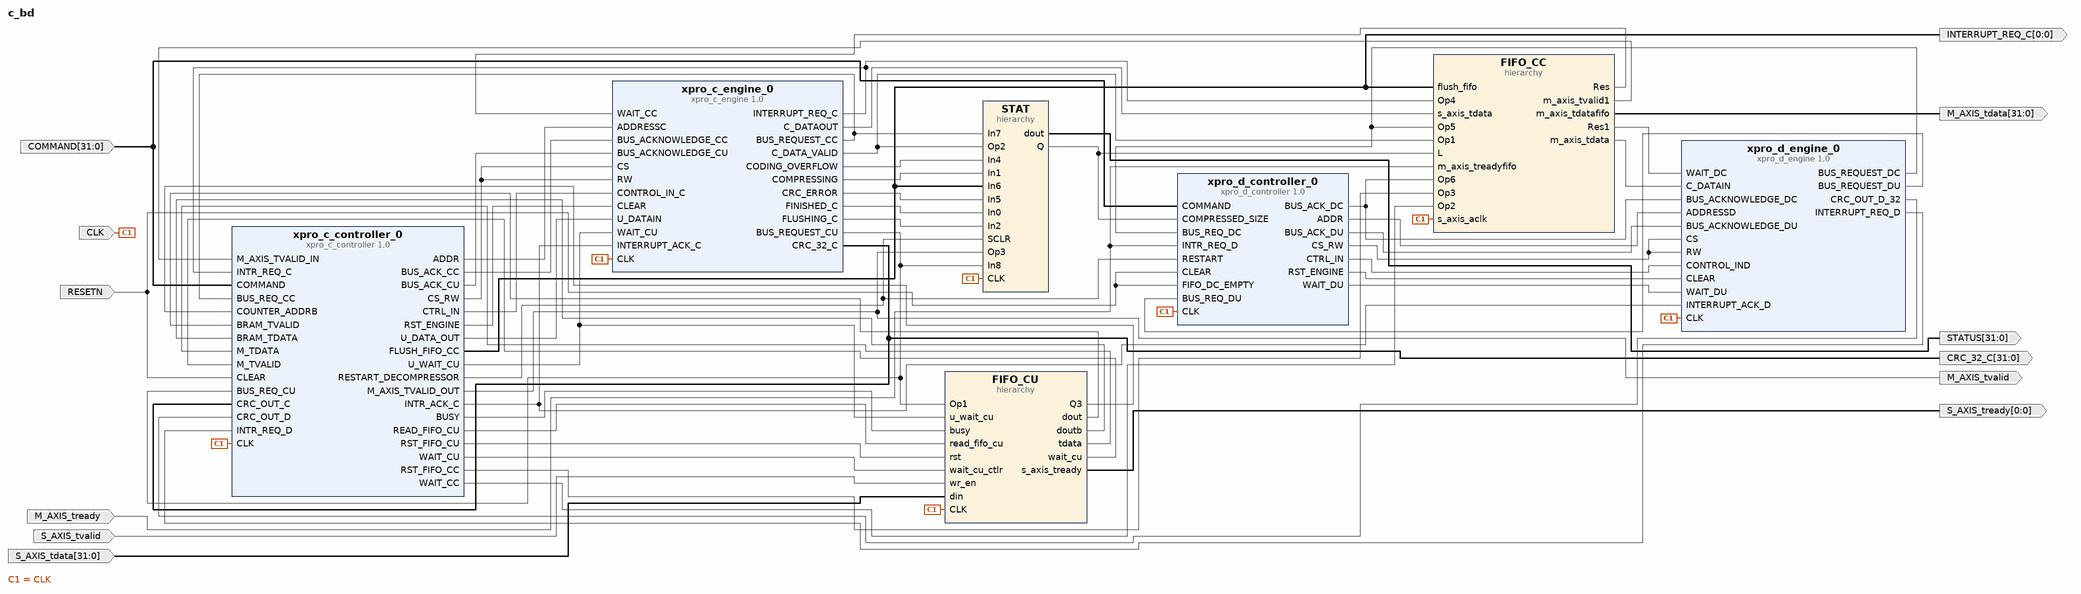
[diagram p0: block diagram of the top level]
# Vivado block design c_bd, Vivado 2014.4
create_bd_design c_bd

create_bd_port -dir I -type clk CLK
create_bd_port -dir I -from 31 -to 0 COMMAND
create_bd_port -dir O -from 31 -to 0 CRC_32_C
create_bd_port -dir O -from 0 -to 0 INTERRUPT_REQ_C
create_bd_port -dir O -from 31 -to 0 M_AXIS_tdata
create_bd_port -dir I M_AXIS_tready
create_bd_port -dir O M_AXIS_tvalid
create_bd_port -dir I RESETN
create_bd_port -dir O -from 31 -to 0 STATUS
create_bd_port -dir I -from 31 -to 0 S_AXIS_tdata
create_bd_port -dir O -from 0 -to 0 S_AXIS_tready
create_bd_port -dir I S_AXIS_tvalid

create_bd_cell -type hier FIFO_CC
create_bd_cell -type hier FIFO_CU
create_bd_cell -type hier STAT
create_bd_cell -type ip -vlnv mohdazainol:user_ip:xpro_c_controller:1.0 xpro_c_controller_0
create_bd_cell -type ip -vlnv mohdazainol:user_ip:xpro_c_engine:1.0 xpro_c_engine_0
create_bd_cell -type ip -vlnv mohdazainol:user_ip:xpro_d_controller:1.0 xpro_d_controller_0
create_bd_cell -type ip -vlnv mohdazainol:user_ip:xpro_d_engine:1.0 xpro_d_engine_0

# ---- hierarchy /FIFO_CC ----
current_bd_instance /FIFO_CC
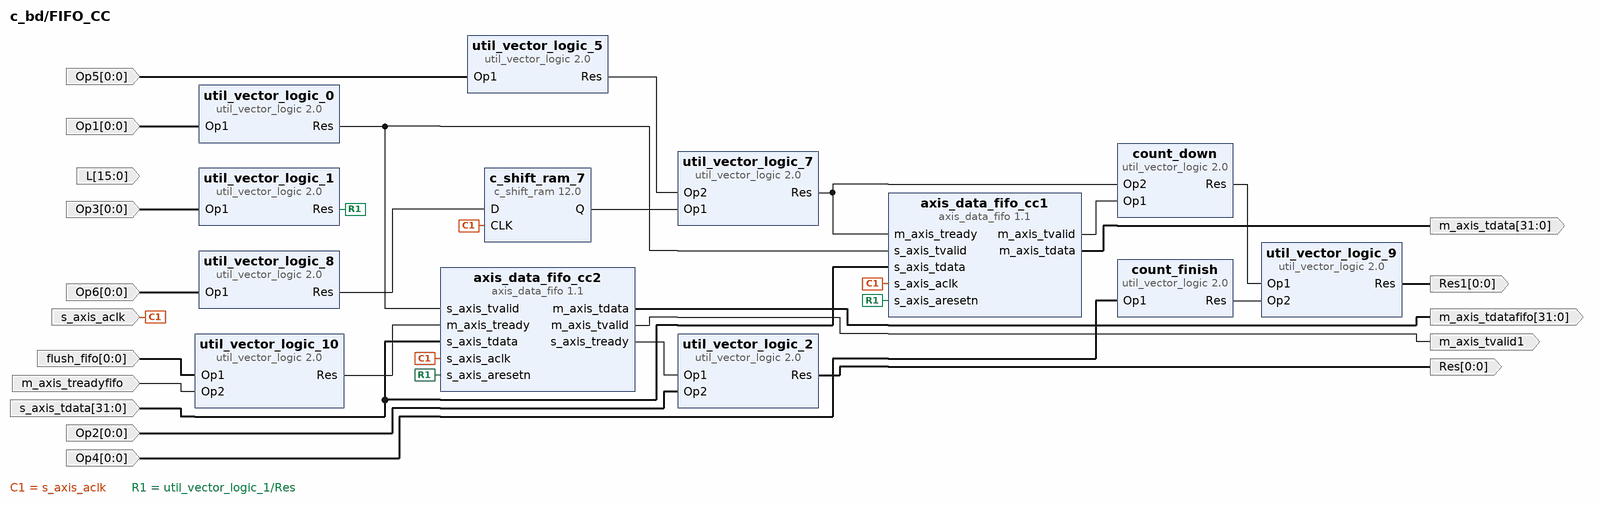
[diagram p1: block diagram inside /FIFO_CC]
create_bd_pin -dir I -from 15 -to 0 L
create_bd_pin -dir I -from 0 -to 0 Op1
create_bd_pin -dir I -from 0 -to 0 Op2
create_bd_pin -dir I -from 0 -to 0 Op3
create_bd_pin -dir I -from 0 -to 0 Op4
create_bd_pin -dir I -from 0 -to 0 Op5
create_bd_pin -dir I -from 0 -to 0 Op6
create_bd_pin -dir O -from 0 -to 0 Res
create_bd_pin -dir O -from 0 -to 0 Res1
create_bd_pin -dir I -from 0 -to 0 flush_fifo
create_bd_pin -dir O -from 31 -to 0 m_axis_tdata
create_bd_pin -dir O -from 31 -to 0 m_axis_tdatafifo
create_bd_pin -dir I m_axis_treadyfifo
create_bd_pin -dir O m_axis_tvalid1
create_bd_pin -dir I -type clk s_axis_aclk
create_bd_pin -dir I -from 31 -to 0 s_axis_tdata

create_bd_cell -type ip -vlnv xilinx.com:ip:axis_data_fifo:1.1 axis_data_fifo_cc1
set_property -dict {CONFIG.TDATA_NUM_BYTES 4 CONFIG.FIFO_DEPTH 64} [get_bd_cells axis_data_fifo_cc1]
create_bd_cell -type ip -vlnv xilinx.com:ip:axis_data_fifo:1.1 axis_data_fifo_cc2
set_property -dict {CONFIG.TDATA_NUM_BYTES 4} [get_bd_cells axis_data_fifo_cc2]
create_bd_cell -type ip -vlnv xilinx.com:ip:c_shift_ram:12.0 c_shift_ram_7
set_property -dict [list \
  CONFIG.ShiftRegType Fixed_Length \
  CONFIG.CE false \
  CONFIG.Width 1 \
  CONFIG.Depth 1 \
  CONFIG.DefaultData 0 \
  CONFIG.AsyncInitVal 0 \
] [get_bd_cells c_shift_ram_7]
create_bd_cell -type ip -vlnv xilinx.com:ip:util_vector_logic:2.0 count_down
set_property -dict {CONFIG.C_SIZE 1} [get_bd_cells count_down]
create_bd_cell -type ip -vlnv xilinx.com:ip:util_vector_logic:2.0 count_finish
set_property -dict {CONFIG.C_SIZE 1 CONFIG.C_OPERATION not} [get_bd_cells count_finish]
create_bd_cell -type ip -vlnv xilinx.com:ip:util_vector_logic:2.0 util_vector_logic_0
set_property -dict {CONFIG.C_SIZE 1 CONFIG.C_OPERATION not} [get_bd_cells util_vector_logic_0]
create_bd_cell -type ip -vlnv xilinx.com:ip:util_vector_logic:2.0 util_vector_logic_1
set_property -dict {CONFIG.C_SIZE 1 CONFIG.C_OPERATION not} [get_bd_cells util_vector_logic_1]
create_bd_cell -type ip -vlnv xilinx.com:ip:util_vector_logic:2.0 util_vector_logic_2
set_property -dict {CONFIG.C_SIZE 1} [get_bd_cells util_vector_logic_2]
create_bd_cell -type ip -vlnv xilinx.com:ip:util_vector_logic:2.0 util_vector_logic_5
set_property -dict {CONFIG.C_SIZE 1 CONFIG.C_OPERATION not} [get_bd_cells util_vector_logic_5]
create_bd_cell -type ip -vlnv xilinx.com:ip:util_vector_logic:2.0 util_vector_logic_7
set_property -dict {CONFIG.C_SIZE 1} [get_bd_cells util_vector_logic_7]
create_bd_cell -type ip -vlnv xilinx.com:ip:util_vector_logic:2.0 util_vector_logic_8
set_property -dict {CONFIG.C_SIZE 1 CONFIG.C_OPERATION not} [get_bd_cells util_vector_logic_8]
create_bd_cell -type ip -vlnv xilinx.com:ip:util_vector_logic:2.0 util_vector_logic_9
set_property -dict {CONFIG.C_SIZE 1 CONFIG.C_OPERATION or} [get_bd_cells util_vector_logic_9]
create_bd_cell -type ip -vlnv xilinx.com:ip:util_vector_logic:2.0 util_vector_logic_10
set_property -dict {CONFIG.C_SIZE 1} [get_bd_cells util_vector_logic_10]

# ---- hierarchy /FIFO_CU ----
current_bd_instance /FIFO_CU
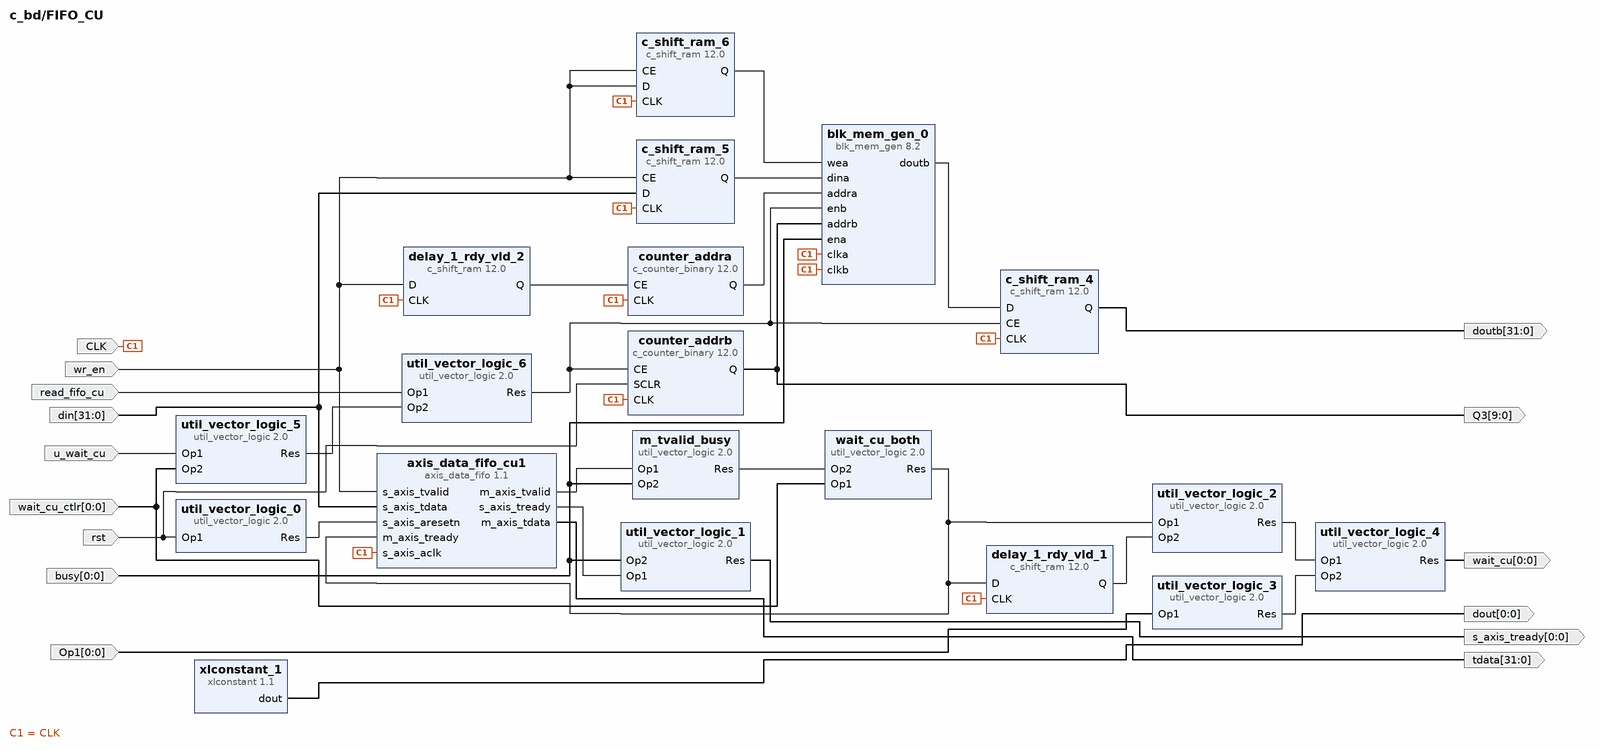
[diagram p2: block diagram inside /FIFO_CU]
create_bd_pin -dir I -type clk CLK
create_bd_pin -dir I -from 0 -to 0 Op1
create_bd_pin -dir O -from 9 -to 0 -type data Q3
create_bd_pin -dir I -from 0 -to 0 -type data busy
create_bd_pin -dir I -from 31 -to 0 din
create_bd_pin -dir O -from 0 -to 0 dout
create_bd_pin -dir O -from 31 -to 0 doutb
create_bd_pin -dir I -type ce read_fifo_cu
create_bd_pin -dir I rst
create_bd_pin -dir O -from 0 -to 0 s_axis_tready
create_bd_pin -dir O -from 31 -to 0 -type data tdata
create_bd_pin -dir I -type ce u_wait_cu
create_bd_pin -dir O -from 0 -to 0 wait_cu
create_bd_pin -dir I -from 0 -to 0 wait_cu_ctlr
create_bd_pin -dir I wr_en

create_bd_cell -type ip -vlnv xilinx.com:ip:axis_data_fifo:1.1 axis_data_fifo_cu1
set_property -dict {CONFIG.TDATA_NUM_BYTES 4 CONFIG.FIFO_DEPTH 64} [get_bd_cells axis_data_fifo_cu1]
create_bd_cell -type ip -vlnv xilinx.com:ip:blk_mem_gen:8.2 blk_mem_gen_0
set_property -dict [list \
  CONFIG.Memory_Type Simple_Dual_Port_RAM \
  CONFIG.Enable_32bit_Address false \
  CONFIG.Use_Byte_Write_Enable false \
  CONFIG.Write_Depth_A 1024 \
  CONFIG.Operating_Mode_A WRITE_FIRST \
  CONFIG.Enable_A Use_ENA_Pin \
  CONFIG.Enable_B Use_ENB_Pin \
  CONFIG.Register_PortB_Output_of_Memory_Primitives false \
  CONFIG.Port_B_Clock 100 \
  CONFIG.Port_B_Enable_Rate 100 \
  CONFIG.use_bram_block Stand_Alone \
] [get_bd_cells blk_mem_gen_0]
create_bd_cell -type ip -vlnv xilinx.com:ip:c_shift_ram:12.0 c_shift_ram_4
set_property -dict [list \
  CONFIG.ShiftRegType Fixed_Length \
  CONFIG.CE true \
  CONFIG.Width 32 \
  CONFIG.Depth 1 \
  CONFIG.DefaultData 00000000000000000000000000000000 \
  CONFIG.AsyncInitVal 00000000000000000000000000000000 \
] [get_bd_cells c_shift_ram_4]
create_bd_cell -type ip -vlnv xilinx.com:ip:c_shift_ram:12.0 c_shift_ram_5
set_property -dict [list \
  CONFIG.ShiftRegType Fixed_Length \
  CONFIG.CE true \
  CONFIG.Width 32 \
  CONFIG.Depth 1 \
  CONFIG.DefaultData 00000000000000000000000000000000 \
  CONFIG.AsyncInitVal 00000000000000000000000000000000 \
] [get_bd_cells c_shift_ram_5]
create_bd_cell -type ip -vlnv xilinx.com:ip:c_shift_ram:12.0 c_shift_ram_6
set_property -dict [list \
  CONFIG.ShiftRegType Fixed_Length \
  CONFIG.CE true \
  CONFIG.Width 1 \
  CONFIG.Depth 1 \
  CONFIG.DefaultData 0 \
  CONFIG.AsyncInitVal 0 \
] [get_bd_cells c_shift_ram_6]
create_bd_cell -type ip -vlnv xilinx.com:ip:c_counter_binary:12.0 counter_addra
set_property -dict [list \
  CONFIG.Output_Width 10 \
  CONFIG.Restrict_Count false \
  CONFIG.CE true \
  CONFIG.SCLR false \
] [get_bd_cells counter_addra]
create_bd_cell -type ip -vlnv xilinx.com:ip:c_counter_binary:12.0 counter_addrb
set_property -dict [list \
  CONFIG.Output_Width 10 \
  CONFIG.Restrict_Count false \
  CONFIG.CE true \
  CONFIG.SCLR true \
] [get_bd_cells counter_addrb]
create_bd_cell -type ip -vlnv xilinx.com:ip:c_shift_ram:12.0 delay_1_rdy_vld_1
set_property -dict {CONFIG.Width 1 CONFIG.Depth 1 CONFIG.DefaultData 0 CONFIG.AsyncInitVal 0} [get_bd_cells delay_1_rdy_vld_1]
create_bd_cell -type ip -vlnv xilinx.com:ip:c_shift_ram:12.0 delay_1_rdy_vld_2
set_property -dict {CONFIG.Width 1 CONFIG.Depth 1 CONFIG.DefaultData 0 CONFIG.AsyncInitVal 0} [get_bd_cells delay_1_rdy_vld_2]
create_bd_cell -type ip -vlnv xilinx.com:ip:util_vector_logic:2.0 m_tvalid_busy
set_property -dict {CONFIG.C_SIZE 1} [get_bd_cells m_tvalid_busy]
create_bd_cell -type ip -vlnv xilinx.com:ip:util_vector_logic:2.0 util_vector_logic_0
set_property -dict {CONFIG.C_SIZE 1 CONFIG.C_OPERATION not} [get_bd_cells util_vector_logic_0]
create_bd_cell -type ip -vlnv xilinx.com:ip:util_vector_logic:2.0 util_vector_logic_1
set_property -dict {CONFIG.C_SIZE 1} [get_bd_cells util_vector_logic_1]
create_bd_cell -type ip -vlnv xilinx.com:ip:util_vector_logic:2.0 util_vector_logic_2
set_property -dict {CONFIG.C_SIZE 1 CONFIG.C_OPERATION or} [get_bd_cells util_vector_logic_2]
create_bd_cell -type ip -vlnv xilinx.com:ip:util_vector_logic:2.0 util_vector_logic_3
set_property -dict {CONFIG.C_SIZE 1 CONFIG.C_OPERATION not} [get_bd_cells util_vector_logic_3]
create_bd_cell -type ip -vlnv xilinx.com:ip:util_vector_logic:2.0 util_vector_logic_4
set_property -dict {CONFIG.C_SIZE 1} [get_bd_cells util_vector_logic_4]
create_bd_cell -type ip -vlnv xilinx.com:ip:util_vector_logic:2.0 util_vector_logic_5
set_property -dict {CONFIG.C_SIZE 1} [get_bd_cells util_vector_logic_5]
create_bd_cell -type ip -vlnv xilinx.com:ip:util_vector_logic:2.0 util_vector_logic_6
set_property -dict {CONFIG.C_SIZE 1 CONFIG.C_OPERATION or} [get_bd_cells util_vector_logic_6]
create_bd_cell -type ip -vlnv xilinx.com:ip:util_vector_logic:2.0 wait_cu_both
set_property -dict {CONFIG.C_SIZE 1} [get_bd_cells wait_cu_both]
create_bd_cell -type ip -vlnv xilinx.com:ip:xlconstant:1.1 xlconstant_1

# ---- hierarchy /STAT ----
current_bd_instance /STAT
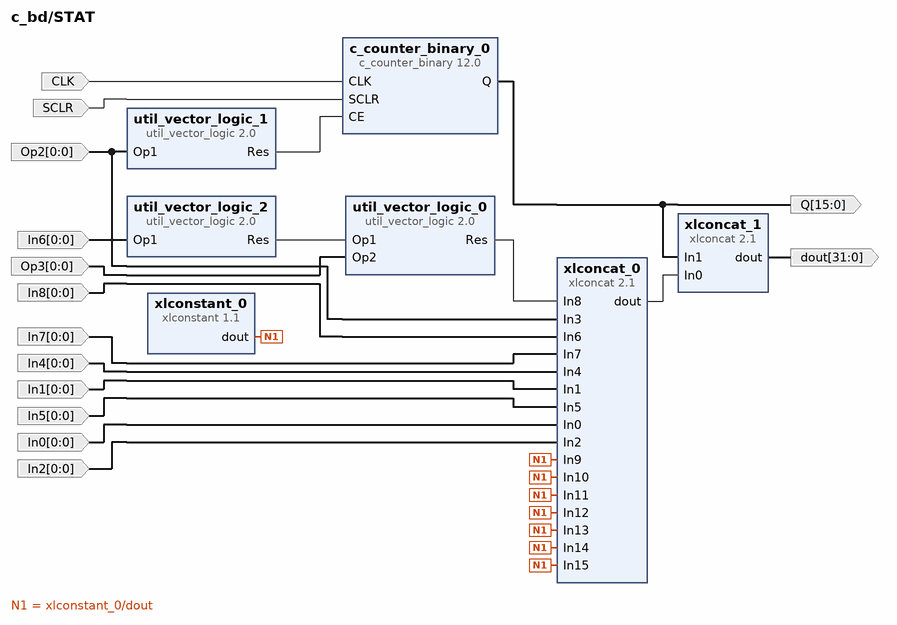
[diagram p3: block diagram inside /STAT]
create_bd_pin -dir I -type clk CLK
create_bd_pin -dir I -from 0 -to 0 In0
create_bd_pin -dir I -from 0 -to 0 In1
create_bd_pin -dir I -from 0 -to 0 In2
create_bd_pin -dir I -from 0 -to 0 In4
create_bd_pin -dir I -from 0 -to 0 In5
create_bd_pin -dir I -from 0 -to 0 In6
create_bd_pin -dir I -from 0 -to 0 In7
create_bd_pin -dir I -from 0 -to 0 In8
create_bd_pin -dir I -from 0 -to 0 Op2
create_bd_pin -dir I -from 0 -to 0 Op3
create_bd_pin -dir O -from 15 -to 0 Q
create_bd_pin -dir I -type rst SCLR
create_bd_pin -dir O -from 31 -to 0 dout

create_bd_cell -type ip -vlnv xilinx.com:ip:c_counter_binary:12.0 c_counter_binary_0
set_property -dict {CONFIG.CE true CONFIG.SCLR true} [get_bd_cells c_counter_binary_0]
create_bd_cell -type ip -vlnv xilinx.com:ip:util_vector_logic:2.0 util_vector_logic_0
set_property -dict {CONFIG.C_SIZE 1 CONFIG.C_OPERATION or} [get_bd_cells util_vector_logic_0]
create_bd_cell -type ip -vlnv xilinx.com:ip:util_vector_logic:2.0 util_vector_logic_1
set_property -dict {CONFIG.C_SIZE 1 CONFIG.C_OPERATION not} [get_bd_cells util_vector_logic_1]
create_bd_cell -type ip -vlnv xilinx.com:ip:util_vector_logic:2.0 util_vector_logic_2
set_property -dict {CONFIG.C_SIZE 1 CONFIG.C_OPERATION not} [get_bd_cells util_vector_logic_2]
create_bd_cell -type ip -vlnv xilinx.com:ip:xlconcat:2.1 xlconcat_0
set_property -dict {CONFIG.NUM_PORTS 16} [get_bd_cells xlconcat_0]
create_bd_cell -type ip -vlnv xilinx.com:ip:xlconcat:2.1 xlconcat_1
set_property -dict {CONFIG.IN0_WIDTH 16 CONFIG.IN1_WIDTH 16} [get_bd_cells xlconcat_1]
create_bd_cell -type ip -vlnv xilinx.com:ip:xlconstant:1.1 xlconstant_0
set_property -dict {CONFIG.CONST_VAL 0} [get_bd_cells xlconstant_0]

# ---- connections ----

current_bd_instance /FIFO_CC
connect_bd_net -net Op1_1 [get_bd_pins Op1] [get_bd_pins util_vector_logic_0/Op1]
connect_bd_net -net Op2_1 [get_bd_pins Op2] [get_bd_pins util_vector_logic_2/Op2]
connect_bd_net -net Op3_1 [get_bd_pins Op3] [get_bd_pins util_vector_logic_1/Op1]
connect_bd_net -net Op4_1 [get_bd_pins Op4] [get_bd_pins count_finish/Op1]
connect_bd_net -net Op5_1 [get_bd_pins Op5] [get_bd_pins util_vector_logic_5/Op1]
connect_bd_net -net Op6_1 [get_bd_pins Op6] [get_bd_pins util_vector_logic_8/Op1]
connect_bd_net -net Op7_1 [get_bd_pins flush_fifo] [get_bd_pins util_vector_logic_10/Op1]
connect_bd_net -net axis_data_fifo_0_m_axis_tdata [get_bd_pins axis_data_fifo_cc2/m_axis_tdata] [get_bd_pins m_axis_tdatafifo]
connect_bd_net -net axis_data_fifo_0_m_axis_tvalid [get_bd_pins axis_data_fifo_cc2/m_axis_tvalid] [get_bd_pins m_axis_tvalid1]
connect_bd_net -net axis_data_fifo_0_s_axis_tready [get_bd_pins axis_data_fifo_cc2/s_axis_tready] [get_bd_pins util_vector_logic_2/Op1]
connect_bd_net -net axis_data_fifo_1_m_axis_tdata [get_bd_pins axis_data_fifo_cc1/m_axis_tdata] [get_bd_pins m_axis_tdata]
connect_bd_net -net axis_data_fifo_1_m_axis_tvalid [get_bd_pins axis_data_fifo_cc1/m_axis_tvalid] [get_bd_pins count_down/Op1]
connect_bd_net [get_bd_pins c_shift_ram_7/Q] [get_bd_pins util_vector_logic_7/Op1]
connect_bd_net [get_bd_pins count_down/Res] [get_bd_pins util_vector_logic_9/Op1]
connect_bd_net [get_bd_pins count_finish/Res] [get_bd_pins util_vector_logic_9/Op2]
connect_bd_net [get_bd_pins m_axis_treadyfifo] [get_bd_pins util_vector_logic_10/Op2]
connect_bd_net [get_bd_pins s_axis_aclk] \
  [get_bd_pins axis_data_fifo_cc1/s_axis_aclk] [get_bd_pins axis_data_fifo_cc2/s_axis_aclk] [get_bd_pins c_shift_ram_7/CLK]
connect_bd_net [get_bd_pins s_axis_tdata] [get_bd_pins axis_data_fifo_cc1/s_axis_tdata] [get_bd_pins axis_data_fifo_cc2/s_axis_tdata]
connect_bd_net [get_bd_pins util_vector_logic_0/Res] [get_bd_pins axis_data_fifo_cc1/s_axis_tvalid] [get_bd_pins axis_data_fifo_cc2/s_axis_tvalid]
connect_bd_net [get_bd_pins util_vector_logic_10/Res] [get_bd_pins axis_data_fifo_cc2/m_axis_tready]
connect_bd_net [get_bd_pins util_vector_logic_1/Res] [get_bd_pins axis_data_fifo_cc1/s_axis_aresetn] [get_bd_pins axis_data_fifo_cc2/s_axis_aresetn]
connect_bd_net [get_bd_pins util_vector_logic_2/Res] [get_bd_pins Res]
connect_bd_net [get_bd_pins util_vector_logic_5/Res] [get_bd_pins util_vector_logic_7/Op2]
connect_bd_net [get_bd_pins util_vector_logic_7/Res] [get_bd_pins axis_data_fifo_cc1/m_axis_tready] [get_bd_pins count_down/Op2]
connect_bd_net [get_bd_pins util_vector_logic_8/Res] [get_bd_pins c_shift_ram_7/D]
connect_bd_net [get_bd_pins util_vector_logic_9/Res] [get_bd_pins Res1]

current_bd_instance /FIFO_CU
connect_bd_net -net CE1_1 [get_bd_pins read_fifo_cu] [get_bd_pins util_vector_logic_6/Op1]
connect_bd_net -net CE_1 [get_bd_pins u_wait_cu] [get_bd_pins util_vector_logic_5/Op1]
connect_bd_net [get_bd_pins CLK] \
  [get_bd_pins axis_data_fifo_cu1/s_axis_aclk] [get_bd_pins blk_mem_gen_0/clka] [get_bd_pins blk_mem_gen_0/clkb] \
  [get_bd_pins c_shift_ram_4/CLK] [get_bd_pins c_shift_ram_5/CLK] [get_bd_pins c_shift_ram_6/CLK] \
  [get_bd_pins counter_addra/CLK] [get_bd_pins counter_addrb/CLK] [get_bd_pins delay_1_rdy_vld_1/CLK] \
  [get_bd_pins delay_1_rdy_vld_2/CLK]
connect_bd_net -net Op1_2 [get_bd_pins Op1] [get_bd_pins util_vector_logic_3/Op1]
connect_bd_net -net axis_data_fifo_0_m_axis_tdata [get_bd_pins axis_data_fifo_cu1/m_axis_tdata] [get_bd_pins tdata]
connect_bd_net -net axis_data_fifo_0_m_axis_tvalid [get_bd_pins axis_data_fifo_cu1/m_axis_tvalid] [get_bd_pins m_tvalid_busy/Op1]
connect_bd_net -net axis_data_fifo_0_s_axis_tready [get_bd_pins axis_data_fifo_cu1/s_axis_tready] [get_bd_pins util_vector_logic_1/Op1]
connect_bd_net [get_bd_pins blk_mem_gen_0/doutb] [get_bd_pins c_shift_ram_4/D]
connect_bd_net [get_bd_pins busy] [get_bd_pins blk_mem_gen_0/ena] [get_bd_pins m_tvalid_busy/Op2] [get_bd_pins util_vector_logic_1/Op2]
connect_bd_net -net c_counter_binary_0_Q [get_bd_pins counter_addra/Q] [get_bd_pins blk_mem_gen_0/addra]
connect_bd_net -net c_counter_binary_1_Q [get_bd_pins counter_addrb/Q] [get_bd_pins Q3] [get_bd_pins blk_mem_gen_0/addrb]
connect_bd_net [get_bd_pins c_shift_ram_4/Q] [get_bd_pins doutb]
connect_bd_net [get_bd_pins c_shift_ram_5/Q] [get_bd_pins blk_mem_gen_0/dina]
connect_bd_net [get_bd_pins c_shift_ram_6/Q] [get_bd_pins blk_mem_gen_0/wea]
connect_bd_net [get_bd_pins delay_1_rdy_vld_1/Q] [get_bd_pins util_vector_logic_2/Op2]
connect_bd_net [get_bd_pins delay_1_rdy_vld_2/Q] [get_bd_pins counter_addra/CE]
connect_bd_net [get_bd_pins din] [get_bd_pins axis_data_fifo_cu1/s_axis_tdata] [get_bd_pins c_shift_ram_5/D]
connect_bd_net [get_bd_pins m_tvalid_busy/Res] [get_bd_pins wait_cu_both/Op2]
connect_bd_net [get_bd_pins rst] [get_bd_pins counter_addrb/SCLR] [get_bd_pins util_vector_logic_0/Op1]
connect_bd_net [get_bd_pins util_vector_logic_0/Res] [get_bd_pins axis_data_fifo_cu1/s_axis_aresetn]
connect_bd_net [get_bd_pins util_vector_logic_1/Res] [get_bd_pins s_axis_tready]
connect_bd_net [get_bd_pins util_vector_logic_2/Res] [get_bd_pins util_vector_logic_4/Op1]
connect_bd_net [get_bd_pins util_vector_logic_3/Res] [get_bd_pins util_vector_logic_4/Op2]
connect_bd_net [get_bd_pins util_vector_logic_4/Res] [get_bd_pins wait_cu]
connect_bd_net [get_bd_pins util_vector_logic_5/Res] [get_bd_pins util_vector_logic_6/Op2]
connect_bd_net [get_bd_pins util_vector_logic_6/Res] [get_bd_pins blk_mem_gen_0/enb] [get_bd_pins c_shift_ram_4/CE] [get_bd_pins counter_addrb/CE]
connect_bd_net [get_bd_pins wait_cu_both/Res] \
  [get_bd_pins axis_data_fifo_cu1/m_axis_tready] [get_bd_pins delay_1_rdy_vld_1/D] [get_bd_pins util_vector_logic_2/Op1]
connect_bd_net [get_bd_pins wait_cu_ctlr] [get_bd_pins util_vector_logic_5/Op2] [get_bd_pins wait_cu_both/Op1]
connect_bd_net [get_bd_pins wr_en] \
  [get_bd_pins axis_data_fifo_cu1/s_axis_tvalid] [get_bd_pins c_shift_ram_5/CE] [get_bd_pins c_shift_ram_6/CE] \
  [get_bd_pins c_shift_ram_6/D] [get_bd_pins delay_1_rdy_vld_2/D]
connect_bd_net [get_bd_pins xlconstant_1/dout] [get_bd_pins dout]

current_bd_instance /STAT
connect_bd_net [get_bd_pins CLK] [get_bd_pins c_counter_binary_0/CLK]
connect_bd_net -net In6_1 [get_bd_pins In6] [get_bd_pins util_vector_logic_2/Op1]
connect_bd_net -net In8_1 [get_bd_pins In8] [get_bd_pins xlconcat_0/In6]
connect_bd_net -net Op3_1 [get_bd_pins Op3] [get_bd_pins util_vector_logic_0/Op2]
connect_bd_net [get_bd_pins SCLR] [get_bd_pins c_counter_binary_0/SCLR]
connect_bd_net [get_bd_pins c_counter_binary_0/Q] [get_bd_pins Q] [get_bd_pins xlconcat_1/In1]
connect_bd_net [get_bd_pins util_vector_logic_0/Res] [get_bd_pins xlconcat_0/In8]
connect_bd_net [get_bd_pins util_vector_logic_1/Res] [get_bd_pins c_counter_binary_0/CE]
connect_bd_net [get_bd_pins util_vector_logic_2/Res] [get_bd_pins util_vector_logic_0/Op1]
connect_bd_net [get_bd_pins xlconcat_0/dout] [get_bd_pins xlconcat_1/In0]
connect_bd_net [get_bd_pins xlconcat_1/dout] [get_bd_pins dout]
connect_bd_net [get_bd_pins xlconstant_0/dout] \
  [get_bd_pins xlconcat_0/In9] [get_bd_pins xlconcat_0/In10] [get_bd_pins xlconcat_0/In11] [get_bd_pins xlconcat_0/In12] \
  [get_bd_pins xlconcat_0/In13] [get_bd_pins xlconcat_0/In14] [get_bd_pins xlconcat_0/In15]
connect_bd_net -net xpro_c_engine_0_BUS_REQUEST_CC [get_bd_pins In7] [get_bd_pins xlconcat_0/In7]
connect_bd_net -net xpro_c_engine_0_CODING_OVERFLOW [get_bd_pins In4] [get_bd_pins xlconcat_0/In4]
connect_bd_net -net xpro_c_engine_0_COMPRESSING [get_bd_pins In1] [get_bd_pins xlconcat_0/In1]
connect_bd_net -net xpro_c_engine_0_CRC_ERROR [get_bd_pins In5] [get_bd_pins xlconcat_0/In5]
connect_bd_net -net xpro_c_engine_0_C_DATA_VALID [get_bd_pins Op2] [get_bd_pins util_vector_logic_1/Op1] [get_bd_pins xlconcat_0/In3]
connect_bd_net -net xpro_c_engine_0_FINISHED_C [get_bd_pins In0] [get_bd_pins xlconcat_0/In0]
connect_bd_net -net xpro_c_engine_0_FLUSHING_C [get_bd_pins In2] [get_bd_pins xlconcat_0/In2]

current_bd_instance /
connect_bd_net [get_bd_ports CLK] \
  [get_bd_pins FIFO_CC/s_axis_aclk] [get_bd_pins FIFO_CU/CLK] [get_bd_pins STAT/CLK] [get_bd_pins xpro_c_controller_0/CLK] \
  [get_bd_pins xpro_c_engine_0/CLK] [get_bd_pins xpro_d_controller_0/CLK] [get_bd_pins xpro_d_engine_0/CLK]
connect_bd_net [get_bd_ports COMMAND] [get_bd_pins xpro_c_controller_0/COMMAND] [get_bd_pins xpro_d_controller_0/COMMAND]
connect_bd_net [get_bd_pins FIFO_CC/Res] [get_bd_pins xpro_c_engine_0/WAIT_CC]
connect_bd_net [get_bd_pins FIFO_CC/Res1] [get_bd_pins xpro_d_engine_0/WAIT_DC]
connect_bd_net -net FIFO_CC_m_axis_tdata [get_bd_pins FIFO_CC/m_axis_tdatafifo] [get_bd_ports M_AXIS_tdata]
connect_bd_net [get_bd_pins FIFO_CC/m_axis_tdata] [get_bd_pins xpro_d_engine_0/C_DATAIN]
connect_bd_net [get_bd_pins FIFO_CC/m_axis_tvalid1] [get_bd_pins xpro_c_controller_0/M_AXIS_TVALID_IN]
connect_bd_net [get_bd_pins FIFO_CU/Q3] [get_bd_pins xpro_c_controller_0/COUNTER_ADDRB]
connect_bd_net [get_bd_pins FIFO_CU/dout] [get_bd_pins xpro_c_controller_0/BRAM_TVALID]
connect_bd_net [get_bd_pins FIFO_CU/doutb] [get_bd_pins xpro_c_controller_0/BRAM_TDATA]
connect_bd_net [get_bd_pins FIFO_CU/s_axis_tready] [get_bd_ports S_AXIS_tready]
connect_bd_net [get_bd_pins FIFO_CU/tdata] [get_bd_pins xpro_c_controller_0/M_TDATA]
connect_bd_net [get_bd_pins FIFO_CU/wait_cu] [get_bd_pins xpro_c_controller_0/M_TVALID]
connect_bd_net [get_bd_ports M_AXIS_tready] [get_bd_pins FIFO_CC/m_axis_treadyfifo] [get_bd_pins xpro_d_controller_0/INTR_REQ_D]
connect_bd_net -net Op4_2 [get_bd_pins xpro_c_engine_0/INTERRUPT_REQ_C] [get_bd_pins FIFO_CC/Op4] [get_bd_pins xpro_c_controller_0/INTR_REQ_C]
connect_bd_net [get_bd_ports RESETN] \
  [get_bd_pins xpro_c_controller_0/CLEAR] [get_bd_pins xpro_d_controller_0/CLEAR] \
  [get_bd_pins xpro_d_controller_0/FIFO_DC_EMPTY]
connect_bd_net [get_bd_pins STAT/Q] [get_bd_pins FIFO_CC/L] [get_bd_pins xpro_d_controller_0/COMPRESSED_SIZE]
connect_bd_net [get_bd_ports S_AXIS_tvalid] [get_bd_pins FIFO_CU/wr_en]
connect_bd_net -net din_1 [get_bd_ports S_AXIS_tdata] [get_bd_pins FIFO_CU/din]
connect_bd_net -net s_axis_tdata_1 [get_bd_pins xpro_c_engine_0/C_DATAOUT] [get_bd_pins FIFO_CC/s_axis_tdata]
connect_bd_net -net xlconcat_1_dout [get_bd_pins STAT/dout] [get_bd_ports STATUS]
connect_bd_net [get_bd_pins xpro_c_controller_0/ADDR] [get_bd_pins xpro_c_engine_0/ADDRESSC]
connect_bd_net [get_bd_pins xpro_c_controller_0/BUSY] [get_bd_pins FIFO_CU/busy]
connect_bd_net [get_bd_pins xpro_c_controller_0/BUS_ACK_CC] [get_bd_pins xpro_c_engine_0/BUS_ACKNOWLEDGE_CC]
connect_bd_net [get_bd_pins xpro_c_controller_0/BUS_ACK_CU] [get_bd_pins xpro_c_engine_0/BUS_ACKNOWLEDGE_CU]
connect_bd_net [get_bd_pins xpro_c_controller_0/CS_RW] [get_bd_pins xpro_c_engine_0/CS] [get_bd_pins xpro_c_engine_0/RW]
connect_bd_net [get_bd_pins xpro_c_controller_0/CTRL_IN] [get_bd_pins xpro_c_engine_0/CONTROL_IN_C]
connect_bd_net [get_bd_pins xpro_c_controller_0/FLUSH_FIFO_CC] [get_bd_ports INTERRUPT_REQ_C] [get_bd_pins FIFO_CC/flush_fifo] [get_bd_pins STAT/In6]
connect_bd_net [get_bd_pins xpro_c_controller_0/INTR_ACK_C] \
  [get_bd_pins xpro_c_engine_0/INTERRUPT_ACK_C] [get_bd_pins xpro_d_engine_0/INTERRUPT_ACK_D]
connect_bd_net [get_bd_pins xpro_c_controller_0/M_AXIS_TVALID_OUT] [get_bd_ports M_AXIS_tvalid] [get_bd_pins STAT/Op3]
connect_bd_net [get_bd_pins xpro_c_controller_0/READ_FIFO_CU] [get_bd_pins FIFO_CU/read_fifo_cu]
connect_bd_net [get_bd_pins xpro_c_controller_0/RESTART_DECOMPRESSOR] [get_bd_pins STAT/SCLR] [get_bd_pins xpro_d_controller_0/RESTART]
connect_bd_net [get_bd_pins xpro_c_controller_0/RST_ENGINE] [get_bd_pins xpro_c_engine_0/CLEAR]
connect_bd_net [get_bd_pins xpro_c_controller_0/RST_FIFO_CC] [get_bd_pins FIFO_CC/Op3]
connect_bd_net [get_bd_pins xpro_c_controller_0/RST_FIFO_CU] [get_bd_pins FIFO_CU/rst]
connect_bd_net [get_bd_pins xpro_c_controller_0/U_DATA_OUT] [get_bd_pins xpro_c_engine_0/U_DATAIN]
connect_bd_net [get_bd_pins xpro_c_controller_0/U_WAIT_CU] [get_bd_pins FIFO_CU/u_wait_cu] [get_bd_pins xpro_c_engine_0/WAIT_CU]
connect_bd_net [get_bd_pins xpro_c_controller_0/WAIT_CC] [get_bd_pins FIFO_CC/Op2]
connect_bd_net [get_bd_pins xpro_c_controller_0/WAIT_CU] [get_bd_pins FIFO_CU/wait_cu_ctlr]
connect_bd_net [get_bd_pins xpro_c_engine_0/BUS_REQUEST_CC] [get_bd_pins STAT/In7] [get_bd_pins xpro_c_controller_0/BUS_REQ_CC]
connect_bd_net [get_bd_pins xpro_c_engine_0/BUS_REQUEST_CU] \
  [get_bd_pins FIFO_CU/Op1] [get_bd_pins STAT/In8] [get_bd_pins xpro_c_controller_0/BUS_REQ_CU]
connect_bd_net [get_bd_pins xpro_c_engine_0/CODING_OVERFLOW] [get_bd_pins STAT/In4]
connect_bd_net [get_bd_pins xpro_c_engine_0/COMPRESSING] [get_bd_pins STAT/In1]
connect_bd_net [get_bd_pins xpro_c_engine_0/CRC_32_C] [get_bd_ports CRC_32_C] [get_bd_pins xpro_c_controller_0/CRC_OUT_C]
connect_bd_net [get_bd_pins xpro_c_engine_0/CRC_ERROR] [get_bd_pins STAT/In5]
connect_bd_net [get_bd_pins xpro_c_engine_0/C_DATA_VALID] [get_bd_pins FIFO_CC/Op1] [get_bd_pins STAT/Op2]
connect_bd_net [get_bd_pins xpro_c_engine_0/FINISHED_C] [get_bd_pins STAT/In0]
connect_bd_net [get_bd_pins xpro_c_engine_0/FLUSHING_C] [get_bd_pins STAT/In2]
connect_bd_net [get_bd_pins xpro_d_controller_0/ADDR] [get_bd_pins xpro_d_engine_0/ADDRESSD]
connect_bd_net [get_bd_pins xpro_d_controller_0/BUS_ACK_DC] [get_bd_pins FIFO_CC/Op6] [get_bd_pins xpro_d_engine_0/BUS_ACKNOWLEDGE_DC]
connect_bd_net [get_bd_pins xpro_d_controller_0/BUS_ACK_DU] [get_bd_pins xpro_d_engine_0/BUS_ACKNOWLEDGE_DU]
connect_bd_net [get_bd_pins xpro_d_controller_0/CS_RW] [get_bd_pins xpro_d_engine_0/CS] [get_bd_pins xpro_d_engine_0/RW]
connect_bd_net [get_bd_pins xpro_d_controller_0/CTRL_IN] [get_bd_pins xpro_d_engine_0/CONTROL_IND]
connect_bd_net [get_bd_pins xpro_d_controller_0/RST_ENGINE] [get_bd_pins xpro_d_engine_0/CLEAR]
connect_bd_net [get_bd_pins xpro_d_controller_0/WAIT_DU] [get_bd_pins xpro_d_engine_0/WAIT_DU]
connect_bd_net [get_bd_pins xpro_d_engine_0/BUS_REQUEST_DC] [get_bd_pins FIFO_CC/Op5] [get_bd_pins xpro_d_controller_0/BUS_REQ_DC]
connect_bd_net [get_bd_pins xpro_d_engine_0/BUS_REQUEST_DU] [get_bd_pins xpro_d_controller_0/BUS_REQ_DU]
connect_bd_net [get_bd_pins xpro_d_engine_0/CRC_OUT_D_32] [get_bd_pins xpro_c_controller_0/CRC_OUT_D]
connect_bd_net [get_bd_pins xpro_d_engine_0/INTERRUPT_REQ_D] [get_bd_pins xpro_c_controller_0/INTR_REQ_D]

validate_bd_design
save_bd_design
